# Altium schematic sheet CAN_Bus.SchDoc: CAN BUS Transiever with MOLEX
size B; Date: 24-02-02; CheckedBy: Jude Thibeault; Author: Kyle Dick; DrawnBy: Kyle Dick; Engineer: Kyle Dick; Organization: Conestoga College; Revision: 3; SheetNumber: 6; SheetTotal: 9
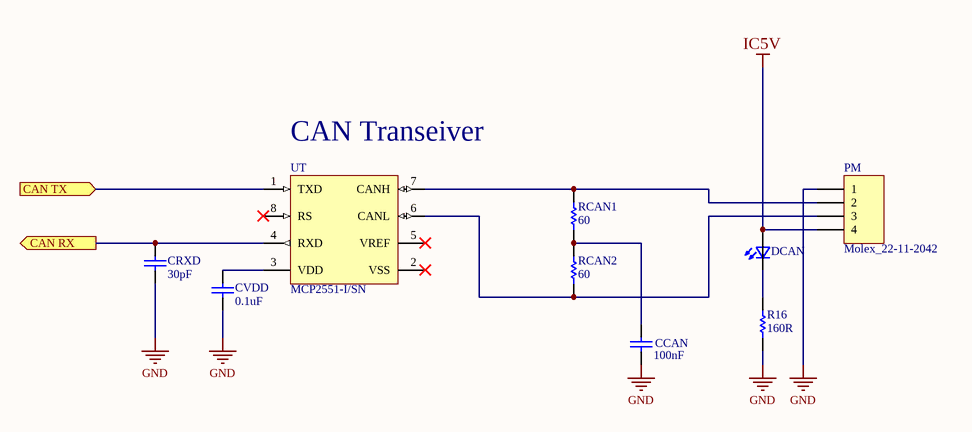
[diagram p0: CAN_Bus.SchDoc]

## Parts
CCAN  value 100nF  (hidden comment: Capacitor)
CRXD  value 30pF  (hidden comment: Capacitor)
CVDD  value 0.1uF  (hidden comment: Capacitor)
DCAN  LTST-S270KRKT  [0603]  (value not drawn)
PM  Molex_22-11-2042  [MOLEX-22-11-2042]
R16  value 160R  (hidden comment: Resistor)
RCAN1  value 60  (hidden comment: Resistor)
RCAN2  value 60  (hidden comment: Resistor)
UT  MCP2551-I/SN  [MCHP-SN8_V]

## Ports
CAN RX (out, see Top Level Hierarchy[3B]), CAN TX (in, see Top Level Hierarchy[3B])

## Nets
GND: CCAN.1 CRXD.1 CVDD.1 PM.1 R16.1
IC5V: DCAN.2(A2) PM.4
CAN RX: CRXD.2 UT.4(RXD) ; port CAN RX
CAN TX: UT.1(TXD) ; port CAN TX
NetCCAN_2: CCAN.2 RCAN1.1 RCAN2.2
NetCVDD_2: CVDD.2 UT.3(VDD)
NetDCAN_1: DCAN.1(K2) R16.2
NetPM_2: PM.2 RCAN1.2 UT.7(CANH)
NetPM_3: PM.3 RCAN2.1 UT.6(CANL)

Not connected (* = marked no-connect by the designer): UT 2(VSS)* 5(VREF)* 8(RS)*

## Notes on the sheet
- (near UT) CAN Transeiver
- ESE
- is the sole property of ESE. Any reproduction
- The Information Contained in this drawing
- Schematic P/N and Name
- Sheet Name
- 850 Fountain St. S.
- Cambridge, ON N3H 0A8
- Canada
- Approved
- in part or in whole without the written
- permission of ESE is strictly prohibited.
- APPROVALS
- DATE
- Size
- Scale
- B
- NTS
- Bare PCB P/N
- Date
- Sheet
- Rev.
- Checked
- Created
- of

## Library data of the parts
CCAN CRXD CVDD = Capacitor: SimulationGenericComponent: True
DCAN = LTST-S270KRKT: http://octopart.com/ltst-c190tbkt-lite-on-550003 / Blue LED; MF: {'manufacturer': u'Lite-On Inc.'}; Package: None; Price: None; Value: *; MP: LTST-S270KRKT; Availability: Unavailable
PM = Molex_22-11-2042: CONN HEADER 4POS .100 VERT GOLD; MPN: 0022112042; PN: WM2702-ND; URL: http://www.digikey.ca/product-detail/en/0022112042/WM2702-ND
R16 RCAN1 RCAN2 = Resistor: TC1: 0; SimulationGenericComponent: True; TC2: 0
UT = CMP-0186-00138-3: High-Speed CAN Transceiver, / 1 Mb/s, 4.5 to 5.5 V, 8-Pin SOIC (SN), Industrial Temperature, RoHS, Tube; Manufacturer: Microchip; RoHSCompliant: true; PackageReference: SN8; ComponentLink1URL: http://www.microchip.com/; DatasheetVersion: Rev. F, 07/2010; ComponentLink2Description: Datasheet; ComponentLink2URL: http://ww1.microchip.com/downloads/en/DeviceDoc/21667f.pdf; ComponentLink3Description: Package Specification; PackageDescription: 8-Pin Small Outline Integrated Circuit, Body 4.9 x 3.9 mm, Pitch 1.27 mm; ComponentLink1Description: Manufacturer URL; Mounting Technology: Surface Mount; ComponentLink3URL: http://www.microchip.com/stellent/groups/techpub_sg/documents/packagingspec/en012702.pdf